# EasyEDA Pro project ProPrj_Summer Robot_2025-05-17-22-39-37.epro

# Schematic Schematic1
Board Name: Board1; Create Date: 2025-05-18; Page Name: P1; Project Name: Summer Robot; Schematic Name: Schematic1; Update Date: 2025-05-17; Company: EasyEDA.com; Page Size: A4; Version: V1.0
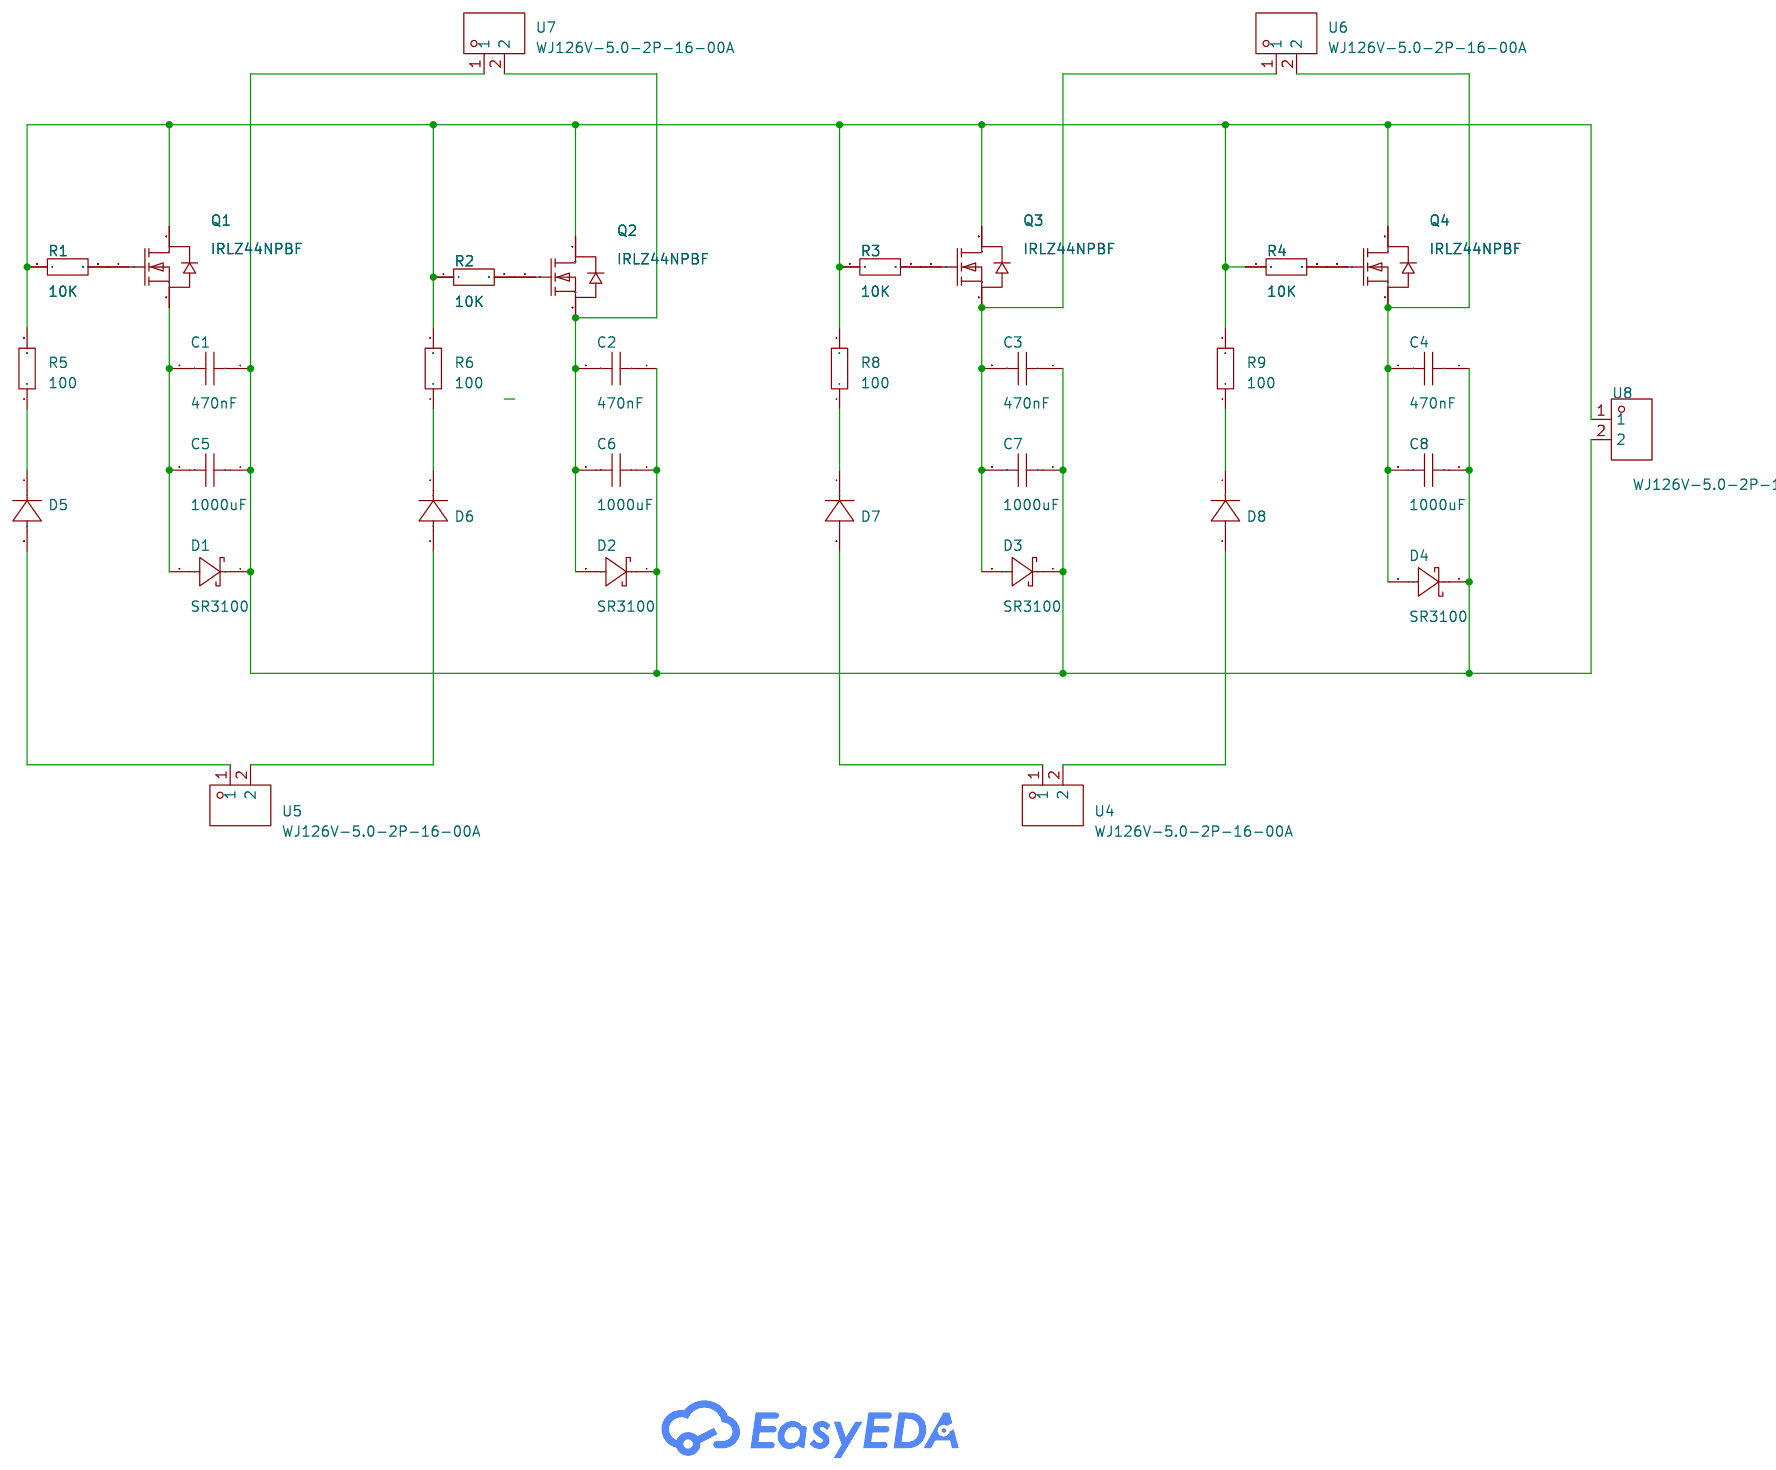
[diagram p0: schematic sheet]

## Parts
C1  470nF  [CAP-TH_L22.9-W10.2-P17.50-D0.8]
C2  470nF  [CAP-TH_L22.9-W10.2-P17.50-D0.8]
C3  470nF  [CAP-TH_L22.9-W10.2-P17.50-D0.8]
C4  470nF  [CAP-TH_L22.9-W10.2-P17.50-D0.8]
C5  1000uF  [C0603]
C6  1000uF  [C0603]
C7  1000uF  [C0603]
C8  1000uF  [C0603]
D1  SR3100  [DO-201AD_BD5.3-L8.4-P12.50-D1.4-RD]
D2  SR3100  [DO-201AD_BD5.3-L8.4-P12.50-D1.4-RD]
D3  SR3100  [DO-201AD_BD5.3-L8.4-P12.50-D1.4-RD]
D4  SR3100  [DO-201AD_BD5.3-L8.4-P12.50-D1.4-RD]
D5  -  [DO-41_BD2.4-L4.7-P8.70-D0.9-RD]
D6  -  [DO-41_BD2.4-L4.7-P8.70-D0.9-RD]
D7  -  [DO-41_BD2.4-L4.7-P8.70-D0.9-RD]
D8  -  [DO-41_BD2.4-L4.7-P8.70-D0.9-RD]
Q1  IRLZ44NPBF  [TO-220-3_L10.0-W4.5-P2.54-T]
Q2  IRLZ44NPBF  [TO-220-3_L10.0-W4.5-P2.54-T]
Q3  IRLZ44NPBF  [TO-220-3_L10.0-W4.5-P2.54-T]
Q4  IRLZ44NPBF  [TO-220-3_L10.0-W4.5-P2.54-T]
R1  10K  [R0603]
R2  10K  [R0603]
R3  10K  [R0603]
R4  10K  [R0603]
R5  100  [R0603]
R6  100  [R0603]
R8  100  [R0603]
R9  100  [R0603]
U4  WJ126V-5.0-2P-16-00A  [CONN-TH_WJ126V-5.0-2P]
U5  WJ126V-5.0-2P-16-00A  [CONN-TH_WJ126V-5.0-2P]
U6  WJ126V-5.0-2P-16-00A  [CONN-TH_WJ126V-5.0-2P]
U7  WJ126V-5.0-2P-16-00A  [CONN-TH_WJ126V-5.0-2P]
U8  WJ126V-5.0-2P-16-00A  [CONN-TH_WJ126V-5.0-2P]

## Library data of the parts
C1-C8 = CAP_0603: Supplier Footprint: 0603
D1-D4 = SR3100_C698900: Diode Configuration:Independent Type Voltage - Forward(Vf@If):850mV@3A Voltage - DC Reverse(Vr):100V Current - Rectified:3A Reverse Leakage Current (Ir):100uA@100V; LCSC Part Name: 电压:100V 电流:3A; Supplier Part: C698900; Manufacturer: YANGJIE(扬杰); Supplier Footprint: DO-27; JLCPCB Part Class: Extended Part; Datasheet: https://atta.szlcsc.com/upload/public/pdf/source/20200709/C698900_6D78AD0DF45561612416347AC03E8208.pdf; Supplier: LCSC; Diode Configuration: Independent Type; Voltage - Forward(Vf@If): 850mV@3A; Voltage - DC Reverse(Vr): 100V; Current - Rectified: 3A; Reverse Leakage Current (Ir): 100uA@100V
D5-D8 = 1N4007: Supplier Footprint: DO-41
Q1-Q4 = IRLZ44NPBF: Type:1 N-Channel Drain Source Voltage (Vdss): Continuous Drain Current (Id): Drain Source On Resistance (RDS(on)@Vgs,Id):0.025Ω@5.0V,25A Power Dissipation (Pd): Gate Threshold Voltage (Vgs(th)@Id):1V@250uA Total Gate Charge (Qg@Vgs):48nC Input Capacitance; LCSC Part Name: 1个N沟道 耐压:55V 电流:47A; Supplier Part: C38774; Manufacturer: Infineon(英飞凌); Supplier Footprint: TO-220AB; JLCPCB Part Class: Extended Part; Datasheet: https://atta.szlcsc.com/upload/public/pdf/source/20141125/1457707250505.pdf; Supplier: LCSC; Type: 1 N-Channel; Drain Source On Resistance (RDS(on)@Vgs,Id): 0.025Ω@5.0V,25A; Gate Threshold Voltage (Vgs(th)@Id): 1V@250uA; Total Gate Charge (Qg@Vgs): 48nC; Input Capacitance (Ciss@Vds): 1.7nF; Reverse Transfer Capacitance (Crss@Vds): 150pF; Operating Temperature: -55℃~+175℃
R1-R6 R8 R9 = Res_0603: Supplier Footprint: 0603
U4-U8 = WJ126V-5.0-2P-16-00A: LCSC Part Name: 直插式/5.0mm 2P 红色; Supplier Part: C3031437; Manufacturer: KANGNEX(康奈克斯电气); Supplier Footprint: P=5mm; JLCPCB Part Class: Extended Part; Datasheet: https://atta.szlcsc.com/upload/public/pdf/source/20191225/C8379_3D37D98EF6F0ECCD8D2EB72C93E46299.pdf; Supplier: LCSC

## Nets
$1N1159: Q1.2(D) Q2.2(D) Q3.2(D) Q4.2(D) R1.1 R2.1 R3.1 R4.1 R5.2 R6.2 R8.2 R9.2 U8.1
$1N1315: Q4.1(G) R4.2
$1N1376: D8.1(K) R9.1
$1N1382: Q3.1(G) R3.2
$1N1384: Q2.1(G) R2.2
$1N1386: Q1.1(G) R1.2
$1N1420: C4.2 C8.2 D4.2(A) Q4.3(S) U6.2
$1N1426: C1.1 C2.1 C3.1 C4.1 C5.1 C6.1 C7.1 C8.1 D1.1(K) D2.1(K) D3.1(K) D4.1(K) U7.1 U8.2
$1N1432: D8.2(A) U4.2
$1N1435: C3.2 C7.2 D3.2(A) Q3.3(S) U6.1
$1N1443: D7.1(K) R8.1
$1N1558: C2.2 C6.2 D2.2(A) Q2.3(S) U7.2
$1N1571: D6.1(K) R6.1
$1N1599: C1.2 C5.2 D1.2(A) Q1.3(S)
$1N1611: D5.1(K) R5.1
$1N2155: D5.2(A) U5.1
$1N2160: D6.2(A) U5.2
$1N2166: D7.2(A) U4.1

# Board PCB3
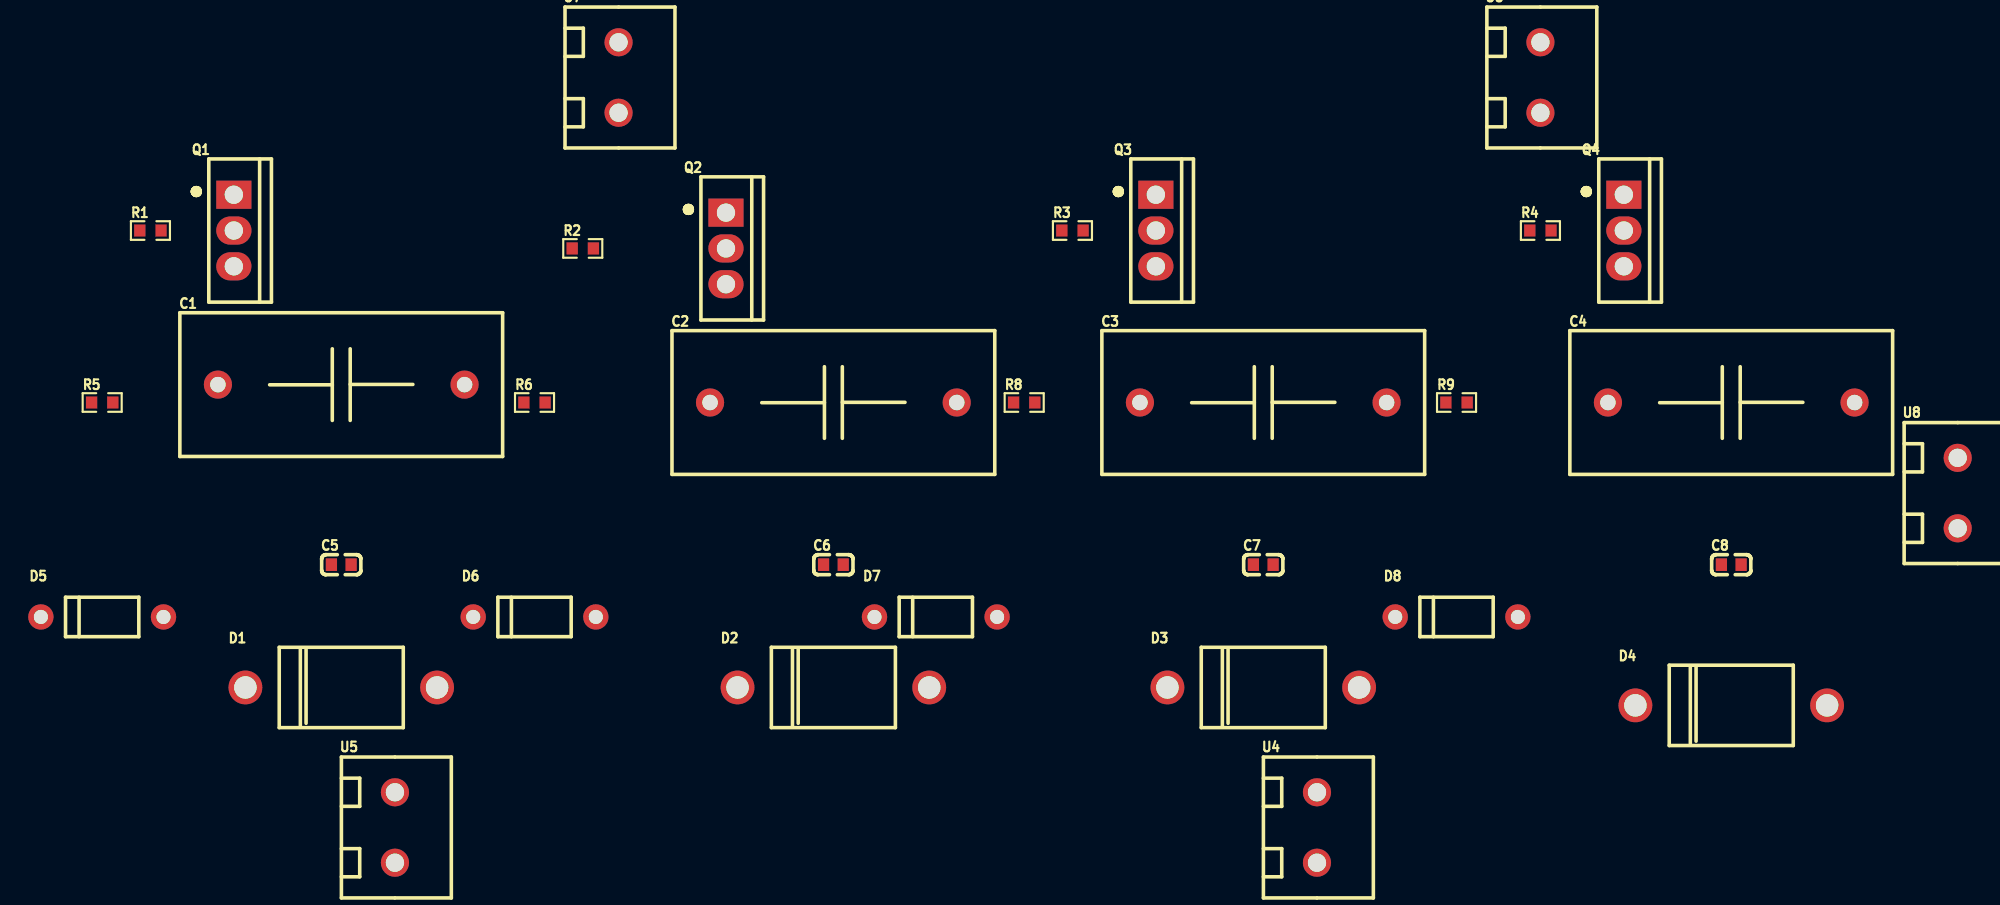
[diagram p1: board, top side]
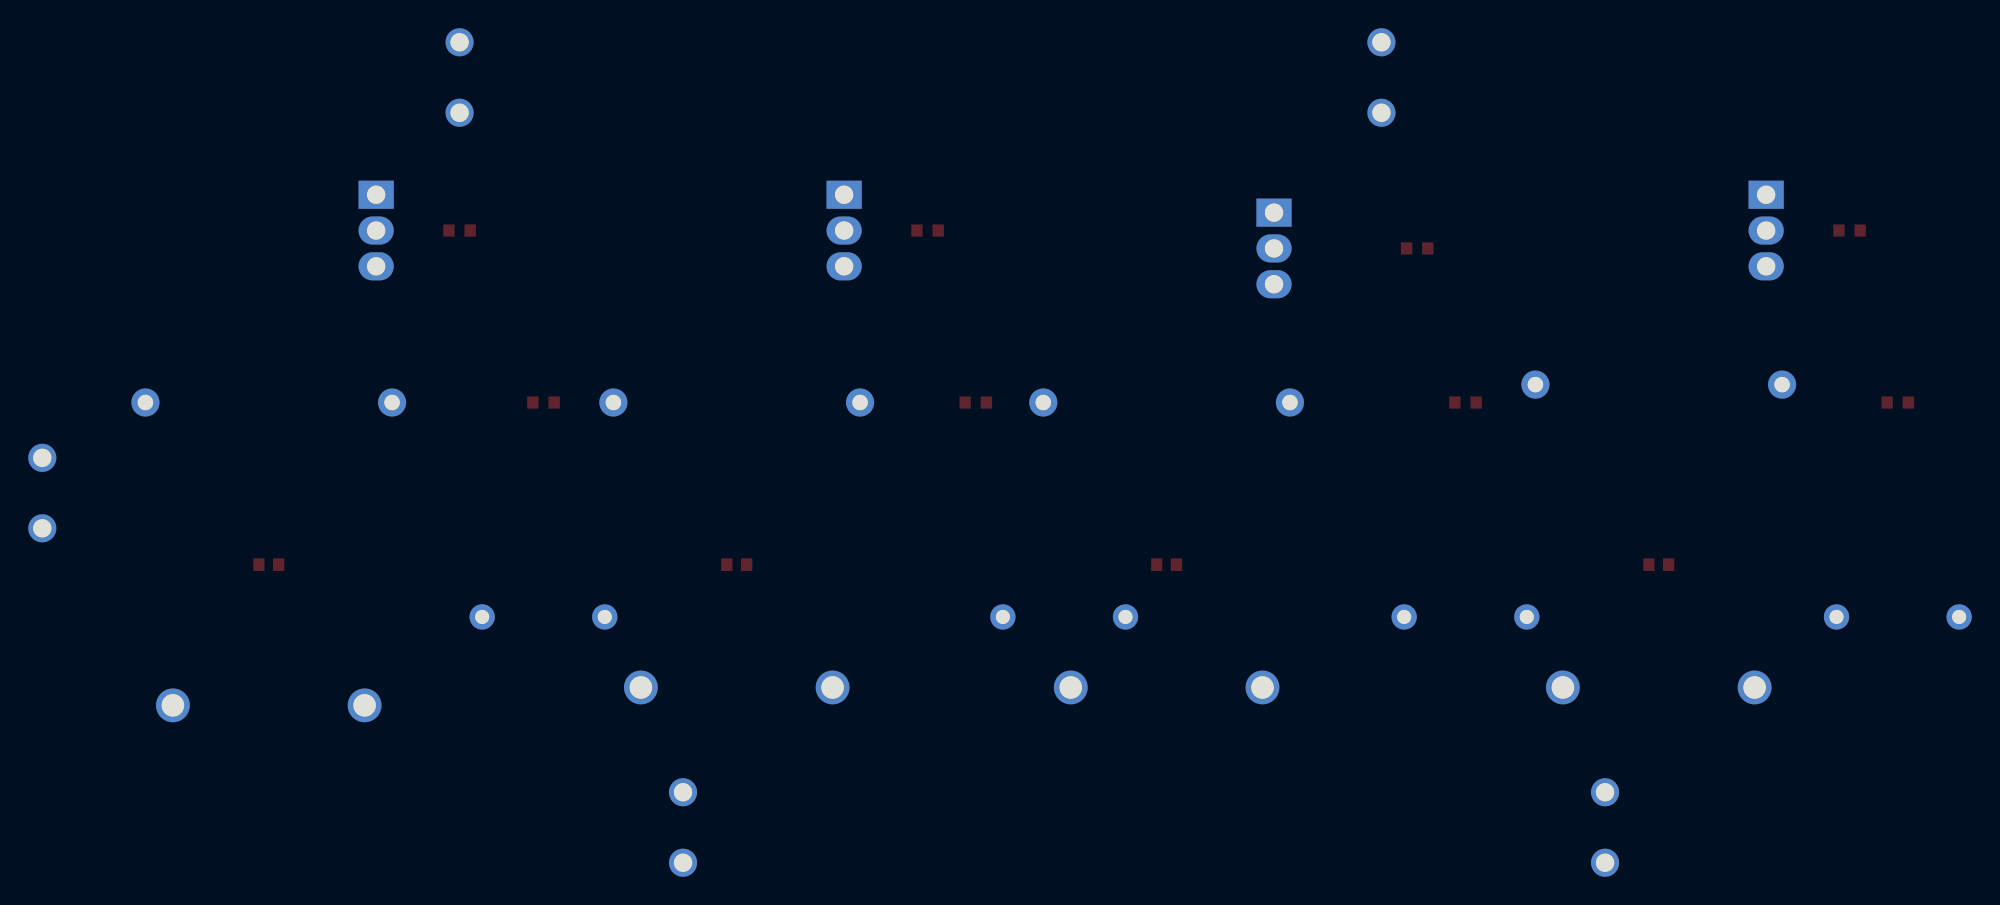
[diagram p2: board, bottom side, seen from below]

No outline. copper layers: Top Layer, Bottom Layer. Coordinates in mm from the lowest, leftmost part position.
Stack: Top Layer 0.035mm / Dielectric1 1.51mm FR4 er 4.5 / Bottom Layer 0.035mm

## Design rules (mm)
template: JLCPCB Capability(Two Layers Board)
spacing copperThickness1oz (default): track to track 0.102, other pairs 0.152 to 0.3
spacing copperThickness2oz: track to track 0.203, other pairs 0.152 to 0.3
track width copperThickness1oz (default): min 0.127, default 0.254, max 2.54
track width copperThickness2oz: min 0.203, default 0.254, max 2.54
differential pair differentialPair (default): width min 0.127, default 0.254, max 2.54; gap min 0.152, default 0.152
via viaSize (default): diameter min 0.5, default 0.61, max 10; hole min 0.3, default 0.305, max 6.3

## Placement (name value [footprint] x y rotation side)
C1  470nF  [CAP-TH_L22.9-W10.2-P17.50-D0.8]  16.96 31.43 0 top
C2  470nF  [CAP-TH_L22.9-W10.2-P17.50-D0.8]  51.88 30.16 0 top
C3  470nF  [CAP-TH_L22.9-W10.2-P17.50-D0.8]  82.38 30.16 0 top
C4  470nF  [CAP-TH_L22.9-W10.2-P17.50-D0.8]  115.58 30.16 0 top
C5  1000uF  [C0603]  16.96 18.65 0 top
C6  1000uF  [C0603]  51.88 18.65 0 top
C7  1000uF  [C0603]  82.38 18.65 0 top
C8  1000uF  [C0603]  115.58 18.65 0 top
D1  SR3100  [DO-201AD_BD5.3-L8.4-P12.50-D1.4-RD]  16.96 9.94 0 top
D2  SR3100  [DO-201AD_BD5.3-L8.4-P12.50-D1.4-RD]  51.88 9.94 0 top
D3  SR3100  [DO-201AD_BD5.3-L8.4-P12.50-D1.4-RD]  82.38 9.94 0 top
D4  SR3100  [DO-201AD_BD5.3-L8.4-P12.50-D1.4-RD]  115.58 8.67 0 top
D5  -  [DO-41_BD2.4-L4.7-P8.70-D0.9-RD]  0 14.94 0 top
D6  -  [DO-41_BD2.4-L4.7-P8.70-D0.9-RD]  30.67 14.94 0 top
D7  -  [DO-41_BD2.4-L4.7-P8.70-D0.9-RD]  59.14 14.94 0 top
D8  -  [DO-41_BD2.4-L4.7-P8.70-D0.9-RD]  96.09 14.94 0 top
Q1  IRLZ44NPBF  [TO-220-3_L10.0-W4.5-P2.54-T]  9.34 42.36 0 top
Q2  IRLZ44NPBF  [TO-220-3_L10.0-W4.5-P2.54-T]  44.26 41.09 0 top
Q3  IRLZ44NPBF  [TO-220-3_L10.0-W4.5-P2.54-T]  74.75 42.36 0 top
Q4  IRLZ44NPBF  [TO-220-3_L10.0-W4.5-P2.54-T]  107.96 42.36 0 top
R1  10K  [R0603]  3.42 42.36 0 top
R2  10K  [R0603]  34.1 41.09 0 top
R3  10K  [R0603]  68.84 42.36 0 top
R4  10K  [R0603]  102.04 42.36 0 top
R5  100  [R0603]  0 30.16 0 top
R6  100  [R0603]  30.67 30.16 0 top
R8  100  [R0603]  65.41 30.16 0 top
R9  100  [R0603]  96.09 30.16 0 top
U4  WJ126V-5.0-2P-16-00A  [CONN-TH_WJ126V-5.0-2P]  86.19 0 0 top
U5  WJ126V-5.0-2P-16-00A  [CONN-TH_WJ126V-5.0-2P]  20.77 0 0 top
U6  WJ126V-5.0-2P-16-00A  [CONN-TH_WJ126V-5.0-2P]  102.04 53.22 0 top
U7  WJ126V-5.0-2P-16-00A  [CONN-TH_WJ126V-5.0-2P]  36.64 53.22 0 top
U8  WJ126V-5.0-2P-16-00A  [CONN-TH_WJ126V-5.0-2P]  131.64 23.73 0 top

## Footprints (pads in the part's own frame, mm; a bottom-side part is the same pattern mirrored in y, then rotated)
C0603
  rect 0.8x0.9 smd: 1(-0.7,0) 2(0.7,0)
CAP-TH_L22.9-W10.2-P17.50-D0.8
  round 2 hole 1.1: 1(-8.75,0) 2(8.75,0)
CONN-TH_WJ126V-5.0-2P
  round 2 hole 1.3: 1(0,2.501) 2(0,-2.501)
DO-41_BD2.4-L4.7-P8.70-D0.9-RD
  round 1.8 hole 1: 1(-4.35,0) 2(4.35,0)
DO-201AD_BD5.3-L8.4-P12.50-D1.4-RD
  round 2.4 hole 1.6: 1(-6.8,0) 2(6.8,0)
R0603
  rect 0.806x0.864 smd: 1(-0.753,0) 2(0.753,0)
TO-220-3_L10.0-W4.5-P2.54-T
  rect 2.5x2 hole 1.3: 1(0,2.54)
  oval 2.5x2 hole 1.3: 2(0,0) 3(0,-2.54)

## Nets
As in the schematic.
